# EAGLE schematic Schematic_RPi_GPBoard_V1 (EAGLE 9.7.0)
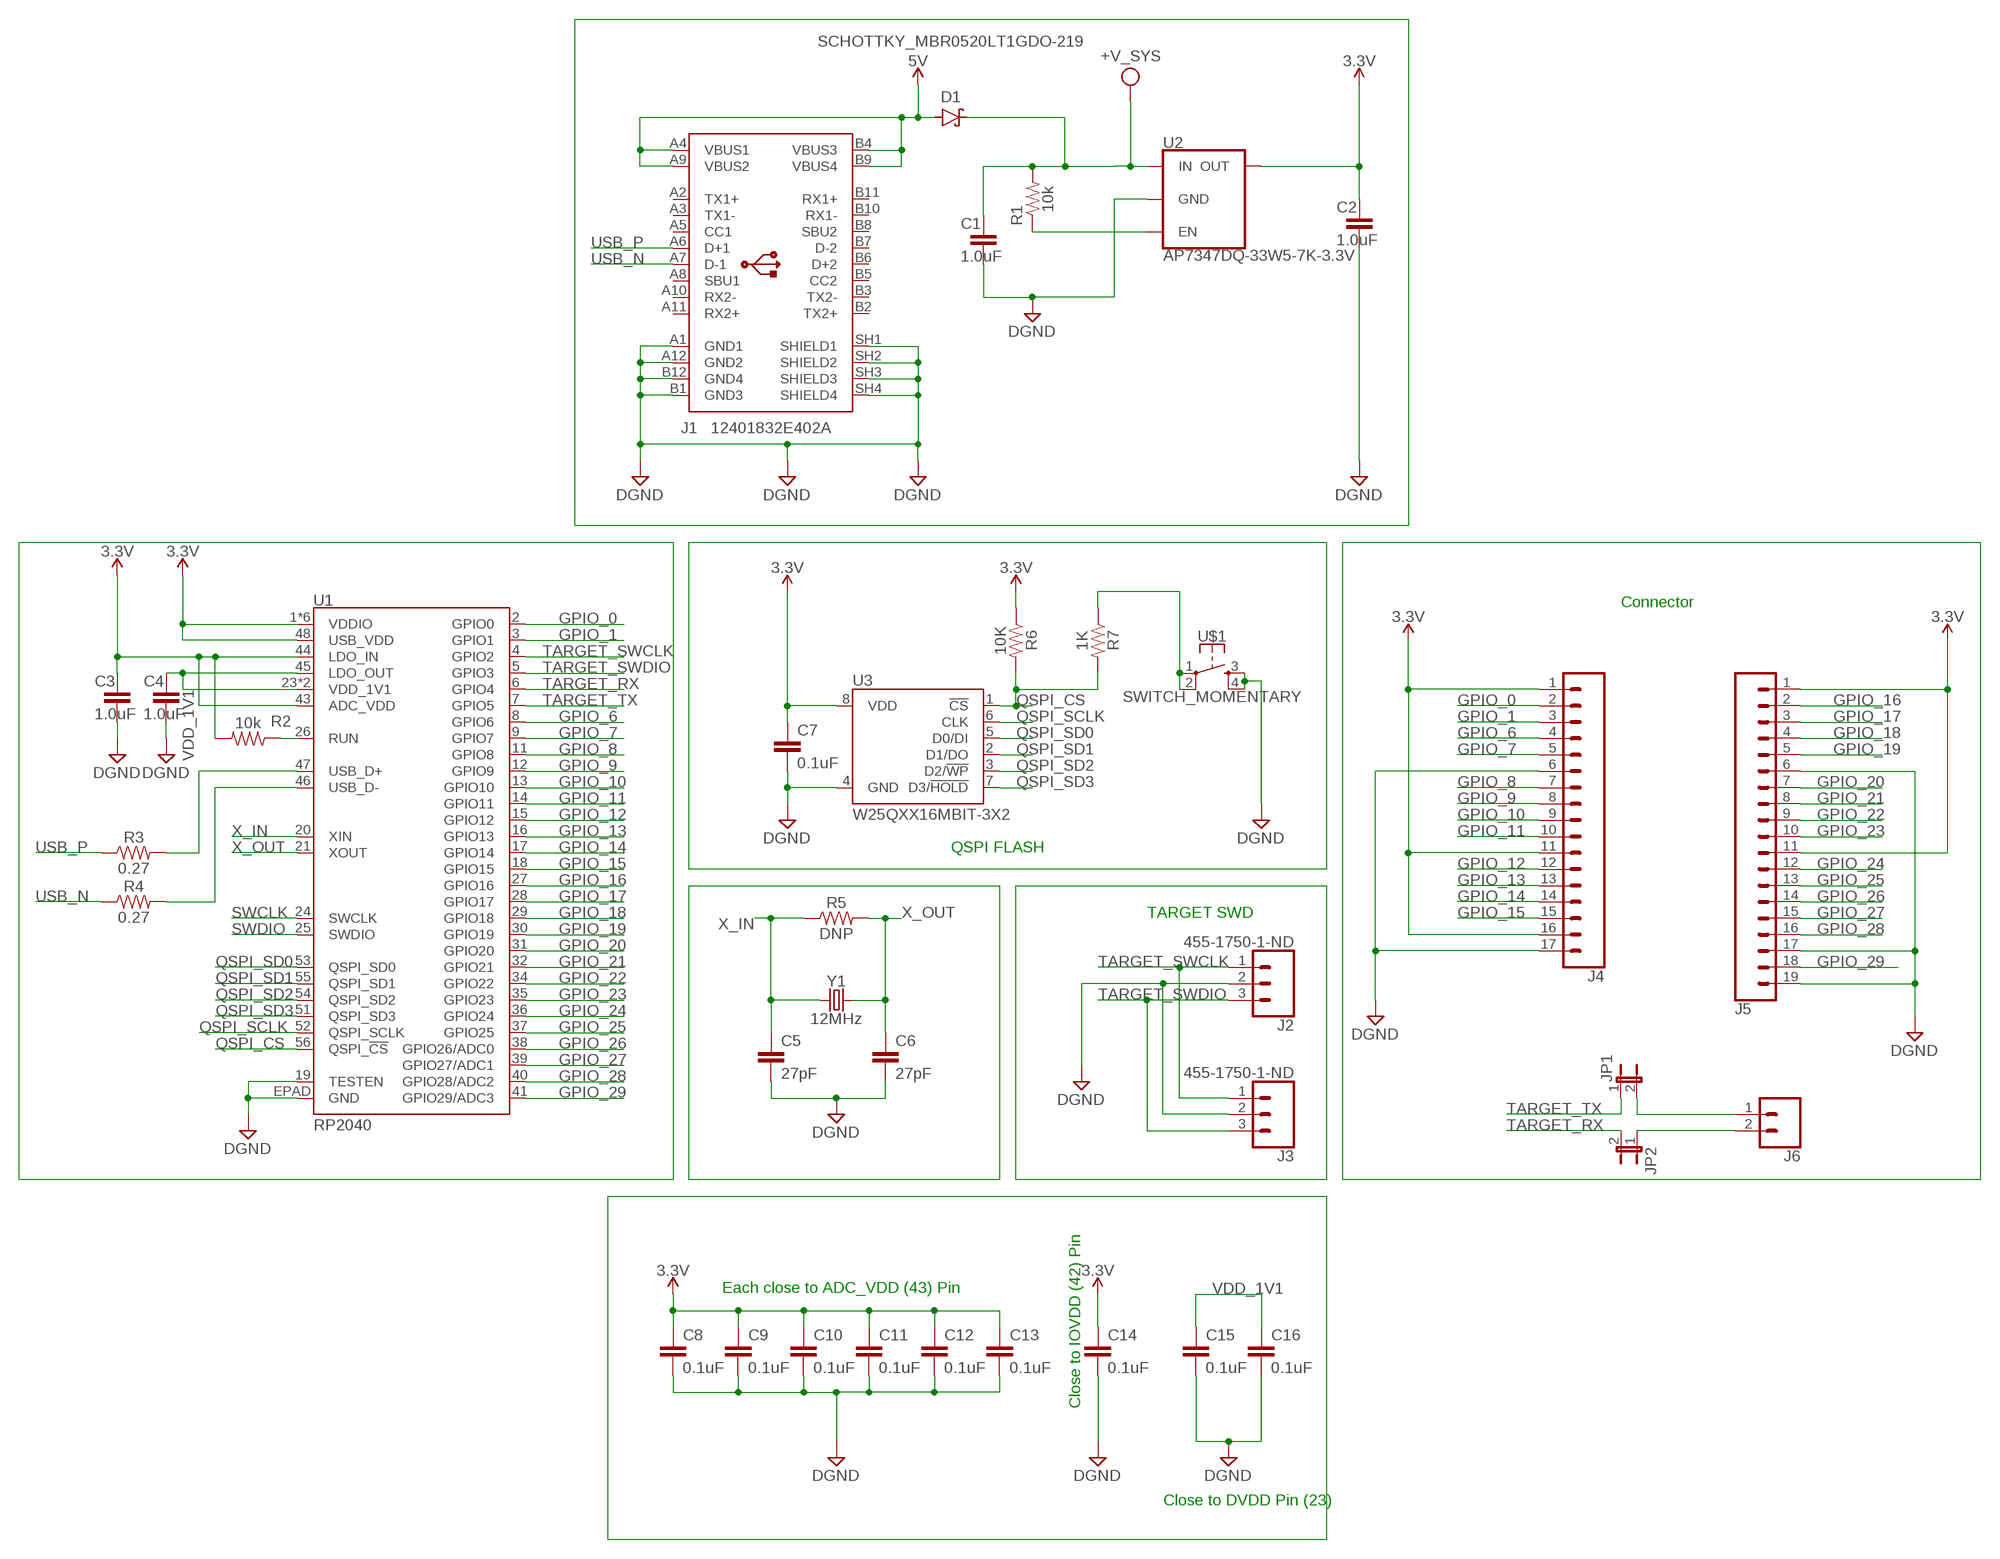
[diagram p0: schematic, sheet 1]

## Parts
C1  1.0uF  1.0UF-0603-16V-10%  [0603]
C2  1.0uF  1.0UF-0603-16V-10%  [0603]
C3  1.0uF  1.0UF-0603-16V-10%  [0603]
C4  1.0uF  1.0UF-0603-16V-10%  [0603]
C5  27pF  27PF-0603-50V-5%  [0603]
C6  27pF  27PF-0603-50V-5%  [0603]
C7  0.1uF  0.1UF-0603-25V-(+80/-20%)  [0603]
C8  0.1uF  0.1UF-0603-25V-(+80/-20%)  [0603]
C9  0.1uF  0.1UF-0603-25V-(+80/-20%)  [0603]
C10  0.1uF  0.1UF-0603-25V-(+80/-20%)  [0603]
C11  0.1uF  0.1UF-0603-25V-(+80/-20%)  [0603]
C12  0.1uF  0.1UF-0603-25V-(+80/-20%)  [0603]
C13  0.1uF  0.1UF-0603-25V-(+80/-20%)  [0603]
C14  0.1uF  0.1UF-0603-25V-(+80/-20%)  [0603]
C15  0.1uF  0.1UF-0603-25V-(+80/-20%)  [0603]
C16  0.1uF  0.1UF-0603-25V-(+80/-20%)  [0603]
D1  SCHOTTKY_MBR0520LT1GDO-219  [SODFL3718X115]
J1  12401832E402A  [12401832E402A]
J2  455-1750-1-ND  CONN_03  [1X03]
J3  455-1750-1-ND  CONN_03  [1X03]
J4  CONN_17NOSILK  [1X17_NO_SILK]
J5  CONN_19  [1X19]
J6  CONN_02  [1X02]
JP1  JUMPER-2SMD-NC  [SJ_2S]
JP2  JUMPER-2SMD-NC  [SJ_2S]
R1  10k  10KOHM-HORIZ-1/4W-1%  [AXIAL-0.3]
R2  10k  10KOHM-HORIZ-1/4W-1%  [AXIAL-0.3]
R3  0.27  0.27OHM-0603-1/10W-1%  [0603]
R4  0.27  0.27OHM-0603-1/10W-1%  [0603]
R5  DNP  DNP-0603  [0603]
R6  10K  105OHM-0603-1/10W-1%  [0603]
R7  1K  105OHM-0603-1/10W-1%  [0603]
U1  RP2040  [QFN-56]
U2  AP7347DQ-33W5-7K-3.3V  [SOT25]
U3  W25QXX16MBIT-3X2  [USON-8]
U$1  SWITCH_MOMENTARY  [SWITCH-MOMENTARY-PTH-6.5MM]
Y1  12MHz  CRYSTAL-12MHZ"  [CRYSTAL-SMD-5X3.2-4PAD]

## Nets
3.3V: C2.1 C3.1 C7.1 C8.1 C9.1 C10.1 C11.1 C12.1 C13.1 C14.1 J4.1 J4.11 J4.16 J5.1 J5.11 R2.P$2 R6.1 U1.1(VDDIO) U1.10(VDDIO) U1.22(VDDIO) U1.33(VDDIO) U1.42(VDDIO) U1.43(ADC_VDD) U1.44(LDO_IN) U1.48(USB_VDD) U1.49(VDDIO) U2.5(OUT) U3.8(VDD)
5V: D1.2(A) J1.A4(VBUS1) J1.A9(VBUS2) J1.B4(VBUS3) J1.B9(VBUS4)
+V_SYS: C1.1 D1.1(C) R1.P$2 U2.1(IN)
DGND: C1.2 C2.2 C3.2 C4.2 C5.2 C6.2 C7.2 C8.2 C9.2 C10.2 C11.2 C12.2 C13.2 C14.2 C15.2 C16.2 J1.A1(GND1) J1.A12(GND2) J1.B1(GND3) J1.B12(GND4) J1.SH1(SHIELD1) J1.SH2(SHIELD2) J1.SH3(SHIELD3) J1.SH4(SHIELD4) J2.2 J3.2 J4.6 J4.17 J5.6 J5.17 J5.19 U1.19(TESTEN) U1.EPAD(GND) U2.2(GND) U3.4(GND) U$1.3 U$1.4
GPIO_0: J4.2 U1.2(GPIO0)
GPIO_1: J4.3 U1.3(GPIO1)
GPIO_6: J4.4 U1.8(GPIO6)
GPIO_7: J4.5 U1.9(GPIO7)
GPIO_8: J4.7 U1.11(GPIO8)
GPIO_9: J4.8 U1.12(GPIO9)
GPIO_10: J4.9 U1.13(GPIO10)
GPIO_11: J4.10 U1.14(GPIO11)
GPIO_12: J4.12 U1.15(GPIO12)
GPIO_13: J4.13 U1.16(GPIO13)
GPIO_14: J4.14 U1.17(GPIO14)
GPIO_15: J4.15 U1.18(GPIO15)
GPIO_16: J5.2 U1.27(GPIO16)
GPIO_17: J5.3 U1.28(GPIO17)
GPIO_18: J5.4 U1.29(GPIO18)
GPIO_19: J5.5 U1.30(GPIO19)
GPIO_20: J5.7 U1.31(GPIO20)
GPIO_21: J5.8 U1.32(GPIO21)
GPIO_22: J5.9 U1.34(GPIO22)
GPIO_23: J5.10 U1.35(GPIO23)
GPIO_24: J5.12 U1.36(GPIO24)
GPIO_25: J5.13 U1.37(GPIO25)
GPIO_26: J5.14 U1.38(GPIO26/ADC0)
GPIO_27: J5.15 U1.39(GPIO27/ADC1)
GPIO_28: J5.16 U1.40(GPIO28/ADC2)
GPIO_29: J5.18 U1.41(GPIO29/ADC3)
N$1: R1.P$1 U2.3(EN)
N$4: R2.P$1 U1.26(RUN)
N$5: R3.2 U1.47(USB_D+)
N$6: R4.2 U1.46(USB_D-)
N$10: R7.1 U$1.1 U$1.2
N$14: J6.1 JP1.2
N$15: J6.2 JP2.1
QSPI_CS: R6.2 R7.2 U1.56(QSPI_!CS!) U3.1(!CS!)
QSPI_SCLK: U1.52(QSPI_SCLK) U3.6(CLK)
QSPI_SD0: U1.53(QSPI_SD0) U3.5(D0/DI)
QSPI_SD1: U1.55(QSPI_SD1) U3.2(D1/DO)
QSPI_SD2: U1.54(QSPI_SD2) U3.3(D2/!WP!)
QSPI_SD3: U1.51(QSPI_SD3) U3.7(D3/!HOLD!)
SWCLK: U1.24(SWCLK)
SWDIO: U1.25(SWDIO)
TARGET_RX: JP2.2 U1.6(GPIO4)
TARGET_SWCLK: J2.1 J3.1 U1.4(GPIO2)
TARGET_SWDIO: J2.3 J3.3 U1.5(GPIO3)
TARGET_TX: JP1.1 U1.7(GPIO5)
USB_N: J1.A7(D-1) R4.1
USB_P: J1.A6(D+1) R3.1
VDD_1V1: C4.1 C15.1 C16.1 U1.23(VDD_1V1) U1.45(LDO_OUT) U1.50(VDD_1V1)
X_IN: C5.1 R5.1 U1.20(XIN) Y1.1
X_OUT: C6.1 R5.2 U1.21(XOUT) Y1.3
Unconnected: J1.A2(TX1+) J1.A3(TX1-) J1.A5(CC1) J1.A8(SBU1) J1.A10(RX2-) J1.A11(RX2+) J1.B2(TX2+) J1.B3(TX2-) J1.B5(CC2) J1.B6(D+2) J1.B7(D-2) J1.B8(SBU2) J1.B10(RX1-) J1.B11(RX1+)

## Notes on the sheet
- Connector
- QSPI FLASH
- TARGET SWD
- Each close to ADC_VDD (43) Pin
- Close to IOVDD (42) Pin
- Close to DVDD Pin (23)

## Library data of the parts
C1-C4 = SparkFun-Capacitors:1.0UF: 1µF ceramic capacitors A capacitor is a passive two-terminal electrical component used to store electrical energy temporarily in an electric field.; PROD_ID: CAP-00868
C5 C6 = SparkFun-Capacitors:27PF: 27pF ceramic capacitors A capacitor is a passive two-terminal electrical component used to store electrical energy temporarily in an electric field.; PROD_ID: CAP-09989
C7-C16 = SparkFun-Capacitors:0.1UF: 0.1µF ceramic capacitors A capacitor is a passive two-terminal electrical component used to store electrical energy temporarily in an electric field.; PROD_ID: CAP-00810
D1 = Diode:SCHOTTKY_: Schottky Diode - Popular parts; CATEGORY: Diode; DATASHEET: https://www.onsemi.com/download/data-sheet/pdf/mbr0520lt1-d.pdf; DESCRIPTION: Diode 20 V 500mA Surface Mount SOD-123; FORWARD_CURRENT: 500mA; FORWARD_VOLTAGE: 385mV; MANUFACTURER: onsemi; MPN: MBR0520LT1G; OPERATING_TEMPERATURE: -65°C ~ 125°C; PACKAGE_SIZE: SOD-123; PACKAGE_TYPE: SMD; PART_STATUS: ACTIVE; REVERSE_VOLTAGE: 20V; ROHS: COMPLIANT; SERIES: MBR0520; SUBCATEGORY: Schottky Diodes; TYPE: Schottky Power Rectifier; ZENER_VOLTAGE: NA
J1 = Connector_USB:12401832E402A: USB(3.1) Type-C- RCPT- 24POS- SMD-THT-R/A Datasheet <https://cdn.amphenol-icc.com/media/wysiwyg/files/documentation/datasheet/inputoutput/io_usb_type_c.pdf> Drawing <https://cdn.amphenol-icc.com/media/wysiwyg/files/drawing/c12401832e402a.pdf>; CATEGORY: USB Connector; CONTACTS: 24; CURRENT_RATING: 5A; DATASHEET: https://cdn.amphenol-cs.com/media/wysiwyg/files/documentation/datasheet/inputoutput/io_usb_3_2_type_c.pdf; DESCRIPTION: USB-C (USB TYPE-C) USB 3.2 Gen 2 (USB 3.1 Gen 2- Superspeed + (USB 3.1)) Receptacle Connector 24 Position Surface Mount- Right Angle- Through Hole; GENDER: Receptacle; MANUFACTURER: Amphenol ICC (Commercial Products); MPN: 12401832E402A; OPERATING_TEMPERATURE: -40℃ ~ 85℃; PACKAGE_SIZE: NA; PACKAGE_TYPE: SMD; PART_STATUS: ACTIVE; ROHS: COMPLIANT; SERIES: NA; SUBCATEGORY: USB TYPE-C; TYPE: Surface Mount-Right Angle-Through Hole; VOLTAGE_RATING: NA
J2 J3 = SparkFun-Connectors:CONN_03: Multi connection point. Often used as Generic Header-pin footprint for 0.1 inch spaced/style header connections On any of the 0.1 inch spaced packages, you can populate with these: Break Away Headers - Straight <https://www.sparkfun.com/products/116> (PRT-00116) Break Away Male Headers - Right Angle <https://www.sparkfun.com/products/553> (PRT-00553) Female Headers <https://www.sparkfun.com/products/115> (PRT-00115) Break Away Headers - Machine Pin <https://www.sparkfun.com/products/117> (PRT-00117) Break Away Female Headers - Swiss Machine Pin <https://www.sparkfun.com/products/743> (PRT-00743) Stackable Header - 3 Pin (Female, 0.1") <https://www.sparkfun.com/products/13875> (PRT-13875) For SCREWTERMINALS and SPRING TERMINALS visit here: Screw Terimnals on SparkFun.com <https://www.sparkfun.com/search/results?term=Screw+Terminals> (5mm/3.5mm/2.54mm spacing) This device is also useful as a general connection point to wire up your design to another part of your project. Our various solder wires solder well into these plated through hole pads. Hook-Up Wire - Assortment (Stranded, 22 AWG) <https://www.sparkfun.com/products/11375> (PRT-11375) Hook-Up Wire - Assortment (Solid Core, 22 AWG) <https://www.sparkfun.com/products/11367> (PRT-11367) View the entire wire category on our website here <https://www.sparkfun.com/categories/141> Special notes: Molex polarized connector foot print use with SKU : PRT-08232 with associated crimp pins and housings.; PROD_ID: XXX-00000
J4 = SparkFun-Connectors:CONN_17: Multi connection point. Often used as Generic Header-pin footprint for 0.1 inch spaced/style header connections On any of the 0.1 inch spaced packages, you can populate with these: Break Away Headers - Straight <https://www.sparkfun.com/products/116> (PRT-00116) Break Away Male Headers - Right Angle <https://www.sparkfun.com/products/553> (PRT-00553) Female Headers <https://www.sparkfun.com/products/115> (PRT-00115) Break Away Headers - Machine Pin <https://www.sparkfun.com/products/117> (PRT-00117) Break Away Female Headers - Swiss Machine Pin <https://www.sparkfun.com/products/743> (PRT-00743) For SCREWTERMINALS and SPRING TERMINALS visit here: Screw Terimnals on SparkFun.com <https://www.sparkfun.com/search/results?term=Screw+Terminals> (5mm/3.5mm/2.54mm spacing) This device is also useful as a general connection point to wire up your design to another part of your project. Our various solder wires solder well into these plated through hole pads. Hook-Up Wire - Assortment (Stranded, 22 AWG) <https://www.sparkfun.com/products/11375> (PRT-11375) Hook-Up Wire - Assortment (Solid Core, 22 AWG) <https://www.sparkfun.com/products/11367> (PRT-11367) View the entire wire category on our website here <https://www.sparkfun.com/categories/141> Special notes: Molex polarized connector foot print use with SKU : PRT-08231 with associated crimp pins and housings. 1MM SMD Version SKU: PRT-10208 NOTES ON THE VARIANTS LOCK and LOCK_LONGPADS... This footprint was designed to help hold the alignment of a through-hole component (i.e. 6-pin header) while soldering it into place. You may notice that each hole has been shifted either up or down by 0.005 of an inch from it's more standard position (which is a perfectly straight line). This slight alteration caused the pins (the squares in the middle) to touch the edges of the holes. Because they are alternating, it causes a "brace" to hold the component in place. 0.005 has proven to be the perfect amount of "off-center" position when using our standard breakaway headers. Although looks a little odd when you look at the bare footprint, once you have a header in there, the alteration is very hard to notice. Also,if you push a header all the way into place, it is covered up entirely on the bottom side.
J5 = SparkFun-Connectors:CONN_19: Multi connection point. Often used as Generic Header-pin footprint for 0.1 inch spaced/style header connections On any of the 0.1 inch spaced packages, you can populate with these: Break Away Headers - Straight <https://www.sparkfun.com/products/116> (PRT-00116) Break Away Male Headers - Right Angle <https://www.sparkfun.com/products/553> (PRT-00553) Female Headers <https://www.sparkfun.com/products/115> (PRT-00115) Break Away Headers - Machine Pin <https://www.sparkfun.com/products/117> (PRT-00117) Break Away Female Headers - Swiss Machine Pin <https://www.sparkfun.com/products/743> (PRT-00743) For SCREWTERMINALS and SPRING TERMINALS visit here: Screw Terimnals on SparkFun.com <https://www.sparkfun.com/search/results?term=Screw+Terminals> (5mm/3.5mm/2.54mm spacing) This device is also useful as a general connection point to wire up your design to another part of your project. Our various solder wires solder well into these plated through hole pads. Hook-Up Wire - Assortment (Stranded, 22 AWG) <https://www.sparkfun.com/products/11375> (PRT-11375) Hook-Up Wire - Assortment (Solid Core, 22 AWG) <https://www.sparkfun.com/products/11367> (PRT-11367) View the entire wire category on our website here <https://www.sparkfun.com/categories/141> Special notes: Molex polarized connector foot print use with SKU : PRT-08231 with associated crimp pins and housings. 1MM SMD Version SKU: PRT-10208 NOTES ON THE VARIANTS LOCK and LOCK_LONGPADS... This footprint was designed to help hold the alignment of a through-hole component (i.e. 6-pin header) while soldering it into place. You may notice that each hole has been shifted either up or down by 0.005 of an inch from it's more standard position (which is a perfectly straight line). This slight alteration caused the pins (the squares in the middle) to touch the edges of the holes. Because they are alternating, it causes a "brace" to hold the component in place. 0.005 has proven to be the perfect amount of "off-center" position when using our standard breakaway headers. Although looks a little odd when you look at the bare footprint, once you have a header in there, the alteration is very hard to notice. Also,if you push a header all the way into place, it is covered up entirely on the bottom side.
J6 = SparkFun-Connectors:CONN_02: Multi connection point. Often used as Generic Header-pin footprint for 0.1 inch spaced/style header connections On any of the 0.1 inch spaced packages, you can populate with these: Break Away Headers - Straight <https://www.sparkfun.com/products/116> (PRT-00116) Break Away Male Headers - Right Angle <https://www.sparkfun.com/products/553> (PRT-00553) Female Headers <https://www.sparkfun.com/products/115> (PRT-00115) Break Away Headers - Machine Pin <https://www.sparkfun.com/products/117> (PRT-00117) Break Away Female Headers - Swiss Machine Pin <https://www.sparkfun.com/products/743> (PRT-00743) For SCREWTERMINALS and SPRING TERMINALS visit here: Screw Terimnals on SparkFun.com <https://www.sparkfun.com/search/results?term=Screw+Terminals> (5mm/3.5mm/2.54mm spacing) This device is also useful as a general connection point to wire up your design to another part of your project. Our various solder wires solder well into these plated through hole pads. Hook-Up Wire - Assortment (Stranded, 22 AWG) <https://www.sparkfun.com/products/11375> (PRT-11375) Hook-Up Wire - Assortment (Solid Core, 22 AWG) <https://www.sparkfun.com/products/11367> (PRT-11367) View the entire wire category on our website here <https://www.sparkfun.com/categories/141> Special notes: Molex polarized connector foot print use with: PRT-08233 with associated crimp pins and housings. 2.54_SCREWTERM for use with PRT-10571. 3.5mm Screw Terminal footprints for PRT-08084 5mm Screw Terminal footprints for use with PRT-08432
JP1 JP2 = SparkFun-Retired:JUMPER-2: Jumper Basic 0.1" spaced jumper. Use with breakaway headers.
R1 R2 = SparkFun-Resistors:10KOHM: 10kΩ resistor A resistor is a passive two-terminal electrical component that implements electrical resistance as a circuit element. Resistors act to reduce current flow, and, at the same time, act to lower voltage levels within circuits. - Wikipedia; PROD_ID: RES-12183
R3 R4 = SparkFun-Resistors:0.27OHM: 0.27Ω resistor A resistor is a passive two-terminal electrical component that implements electrical resistance as a circuit element. Resistors act to reduce current flow, and, at the same time, act to lower voltage levels within circuits. - Wikipedia; PROD_ID: RES-08787
R5 = SparkFun-Resistors:DNP: Do-Not-Populate resistor A resistor is a passive two-terminal electrical component that implements electrical resistance as a circuit element. Resistors act to reduce current flow, and, at the same time, act to lower voltage levels within circuits. - Wikipedia
R6 R7 = SparkFun-Resistors:105OHM: 105Ω resistor A resistor is a passive two-terminal electrical component that implements electrical resistance as a circuit element. Resistors act to reduce current flow, and, at the same time, act to lower voltage levels within circuits. - Wikipedia; PROD_ID: RES-10751; VALUE: 105
U1 = SparkFun-IC-Microcontroller:RP2040: Raspberry Pi RP2040 MCU 56-pin 32-bit Microcontroller with 264kB of SRAM and external flash support up to 16MB Getting Started with the RP2040 <https://pico.raspberrypi.org/getting-started/> Dual-core ARM Cortex M0+ processor, flexible clock running up to 133 MHz 264kB of SRAM, and QSPI control of common flash memory USB 1.1 Host and Device support Low-power sleep and dormant modes Drag & drop programming using mass storage over USB 26 multi-function GPIO pins 2×SPI, 2×I2C, 2×UART, 3×12-bit ADC, 16×controllable PWM channels Accurate clock and timer on-chip Temperature sensor Accelerated floating point libraries on-chip 8×Programmable IO (PIO) state machines for custom peripheral support; PROD_ID: IC-15502
U2 = SparkFun-IC-Power:AP7347DQ-33W5-7: AP7347DQ - 500mA CMOS LDO Regulator w/ Enable The AP2112 is CMOS process low dropout linear regulator with enable function, the regulator delivers a guaranteed 600mA (min.) continuous load current. Features Output Voltage Accuracy: ±1% Output Current: 500mA Foldback Short Current Protection: 180mA Enable Function to Turn ON/OFF VOUT Low Dropout Voltage (3.3V): 270mV (Typ.) @IOUT=500mA Excellent Load Regulation: 22.5mV Excellent Line Regulation: 0.02%/V (Typ.) Low Quiescent Current: 60μA (Typ.) Low Standby Current: 0.01μA (Typ.) Low Output Noise: 60μVRMS PSRR: 100Hz -65dB, 1kHz -65dB OTSD Protection Stable with 1.0μF Flexible Cap: Ceramic, Tantalum and Aluminum Electrolytic Operation Temperature Range: -40°C to 85°C ESD: MM 400V, HBM 4000V; PROD_ID: VREG-17101
U3 = SparkFun-IC-Memory:W25QXX; PROD_ID: IC-14905
U$1 = Tinkercad:SWITCH_MOMENTARY
Y1 = SparkFun-Clocks:CRYSTAL-12MHZ: 12.0MHz Crystal Frequency: 12.0MHz Frequency Tolerance: ±20ppm Load Capacitance: 18pF SparkFun Products: SparkFun Logomatic <https://www.sparkfun.com/products/12772> Pocket AVR Programmer <https://www.sparkfun.com/products/9825>; PROD_ID: XTAL-08297